# Altium project PROJECT-ESP-C3-13-BREAKOUT.PrjPcb
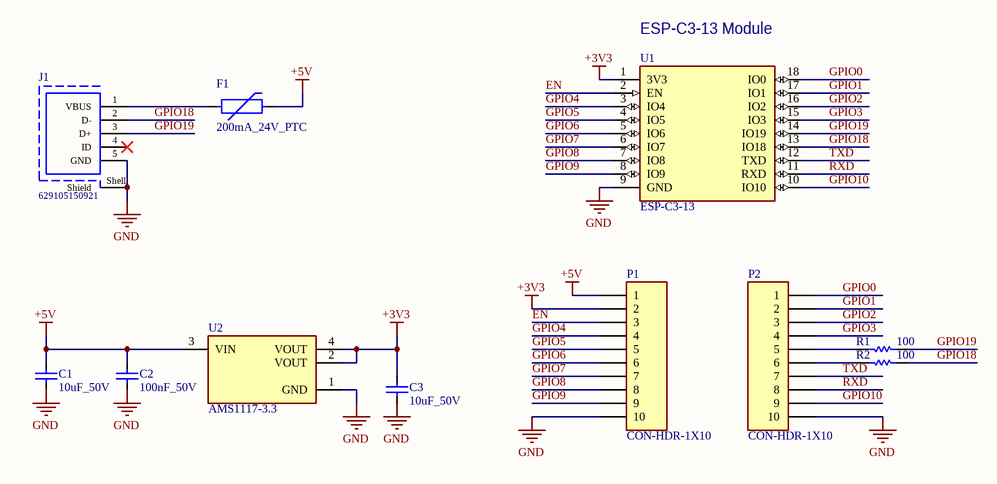
[diagram p0: ESP-C3-13-BREAKOUT.SchDoc]
1 sheet, 11 parts. Net scope: global (net labels, ports and power ports of the same name join across sheets).
Board file: ESP-C3-13-BREAKOUT.PcbDoc

## Sheet ESP-C3-13-BREAKOUT.SchDoc: ESP-C3-13 Breakout Board
size A4; Author: Meysam Parvizi; DrawnBy: Meysam Parvizi; SheetNumber: 1; SheetTotal: 1

### Parts
C1  value 10uF_50V  [C0805]  (hidden comment: C0805C104K5RAC7411)
C2  value 100nF_50V  [C0805]  (hidden comment: C0805C104K5RAC7411)
C3  value 10uF_50V  [C0805]  (hidden comment: C0805C104K5RAC7411)
F1  value 200mA_24V_PTC  [R1206]  (hidden comment: NANOSMDC020F-2)
J1  629105150921  [CON-MICRO-USB-B-SMD-WITH-HOLDER]
P1  CON-HDR-1X10  [CON-HDR-1X10-2.54]
P2  CON-HDR-1X10  [CON-HDR-1X10-2.54]
R1  value 100  [R0805]  (hidden comment: CRG0805F10K)
R2  value 100  [R0805]  (hidden comment: CRG0805F10K)
U1  ESP-C3-13  [ESP-C3-13_NO-KEEPOUT]
U2  AMS1117-3.3  [SOT-223]

### Nets
+3V3: C3.1 P1.2 U1.1(3V3) U2.2(VOUT) U2.4(VOUT)
+5V: C1.1 C2.1 F1.2 P1.1 U2.3(VIN)
GND: C1.2 C2.2 C3.2 J1.5(GND) J1.Shell(Shield) P1.10 P2.10 U1.9(GND) U2.1(GND)
EN: P1.3 U1.2(EN)
GPIO0: P2.1 U1.18(IO0)
GPIO1: P2.2 U1.17(IO1)
GPIO2: P2.3 U1.16(IO2)
GPIO3: P2.4 U1.15(IO3)
GPIO4: P1.4 U1.3(IO4)
GPIO5: P1.5 U1.4(IO5)
GPIO6: P1.6 U1.5(IO6)
GPIO7: P1.7 U1.6(IO7)
GPIO8: P1.8 U1.7(IO8)
GPIO9: P1.9 U1.8(IO9)
GPIO10: P2.9 U1.10(IO10)
GPIO18: J1.2(D-) R2.1 U1.13(IO18)
GPIO19: J1.3(D+) R1.1 U1.14(IO19)
RXD: P2.8 U1.11(RXD)
TXD: P2.7 U1.12(TXD)
NetF1_1: F1.1 J1.1(VBUS)
NetP2_5: P2.5 R1.2
NetP2_6: P2.6 R2.2

Not connected (* = marked no-connect by the designer): J1 4(ID)*

### Notes on the sheet
- (near U1) ESP-C3-13 Module
- Title:
- Designed By:
- Meysam Parvizi
- GitHub:
- https://github.com/m3y54m
- File:
- Project Git Hash:
- Project:
- Date:
- Sheet
- Revision:
- of
- Size:
- A4
- File Git Hash:

### Library data of the parts
C1-C3 = CAPACITOR: C0805 0.10 μF X7R 30ppm/°C 10.00% 50 V; Manufacturer: KEMET; Material: Ceramic; Tolerance: 0.1; Capacitance: 100nF; Voltage Rating: 50 V; Temperature: -55°C to +125°C; Device Class L3: Ceramic Capacitors; Temperature Characteristic: X7R; Device Class L1: Passive Components; Category: Cap; Temperature Coefficient: 30ppm/°C; Manufacturer Part Number: C0805C104K5RAC7411; Temperature Range High: +125°C; Height: 0.88mm; RoHS: TRUE; ComponentLink2Description: Datasheet; Lead Free: Yes; Package: C0805C-DN; Temperature Range Low: -55°C; ComponentLink2URL: https://content.kemet.com/datasheets/KEM_C1003_C0G_SMD.pdf; Automotive: No; Ipc Land Pattern Name: CAPC200125X78; Octopart: https://octopart.com/c0805c104k5rac7411-kemet-18508045; Device Class L2: Capacitors
F1 = FUSE-PTC: FUSE PPTC 200MA (1206) 24V RESETTABLE
J1 = CON-MICRO-USB-AB-RCPT-SMD: Micro USB 2.0 Type AB Receptacle WR-COM, Horizontal, SMT; Manufacturer: Wurth Elektronik; Rated Current: 1.8A; Contact Resistance: 30mOhm; Working Voltage: 30VAC; Publisher: WurthElektronik; Part Number: 629105150921; Operating Temperature: -40to85degC; Gender: Receptacle; Packaging: TapeandReel; Connector Type: MicroUSB2.0TypeAB; Datasheet URL: https://katalog.we-online.de/em/datasheet/629105150921.pdf; Mounting Technology: SMT; Orientation: Horizontal; Package Reference: 629105150921; Manufacturer URL: http://www.we-online.de
P1 P2 = CON-HDR-1X10: Pin Header, 10-Pin; LatestRevisionDate: 17-Jul-2002; LatestRevisionNote: Re-released for DXP Platform.; Publisher: Altium Limited
R1 R2 = RESISTOR: RES SMD 10K OHM 1% 1/8W 0805; Temperature Coefficient: 100ppm/°C; Power Rating: 125mW; Voltage Rating: 150V; Number of Resistors: 1; RoHS Compliant: Yes; Tolerance: 1%; Mount: Surface Mount; Radiation Hardening: No; Depth: 1.25mm; Termination: Solder; Series: CRG Series; Packaging: Tape and Reel; Number of Terminations: 2; Resistor Type: Thick Film; Length: 2mm; Height: 0.55mm; ELV: Compliant; Case/Package: 0805; Min Operating Temperature: -55°C; Max Operating Temperature: 125°C; Technology: THICK FILM
U1 = ESP-C3-13: WiFi Modules (802.11) (Engineering Samples) SMD module, ESP32-C3, 4MB SPI flash, PCB antenna, -40 C +85 C; MP: ESP32-C3-WROOM-02-N4; MF: Espressif Systems; Package: Package; Availability: In Stock; Purchase-URL: https://pricing.snapeda.com/search/part/ESP32-C3-WROOM-02-N4/?ref=eda; SnapEDA_Link: https://www.snapeda.com/parts/ESP32-C3-WROOM-02-N4/Espressif+Systems/view-part/?ref=snap; Price: None; Check_prices: https://www.snapeda.com/parts/ESP32-C3-WROOM-02-N4/Espressif+Systems/view-part/?ref=eda; Value: *
U2 = LD1117: IC REG LINEAR 3.3V 800MA SOT223; Input Bias Current: 5mA; Output Voltage Accuracy: 1%; Dropout Voltage: 1.1V; Power Dissipation: 12W; Polarity: Positive; Min Input Voltage: 5.3V; Quiescent Current: 10mA; Max Output Current: 1.3A; Output Current: 950mA; Number of Regulators: 1; Max Supply Voltage: 15V; Output Type: Fixed; Output Voltage: 3.3V; Number of Terminals: 4; Min Supply Voltage: 3.3V; Termination: SMD/SMT; Mount: Surface Mount; Max Power Dissipation: 12W; Case/Package: SOT-223; Lead Free: Lead Free; Height: 1.8mm; REACH SVHC: No SVHC; Radiation Hardening: No; Width: 3.5mm; Length: 6.5mm; Packaging: Tape and Reel; Max Input Voltage: 15V; Accuracy: 1%; Weight: 0.01lb; Contact Plating: Tin; Max Operating Temperature: 125°C; Number of Pins: 4; Max Output Voltage: 3.3V; Min Operating Temperature: -40°C; Nominal Output Voltage: 3.3V; Package Quantity: 1; Min Output Voltage: 3.3V; Number of Outputs: 1